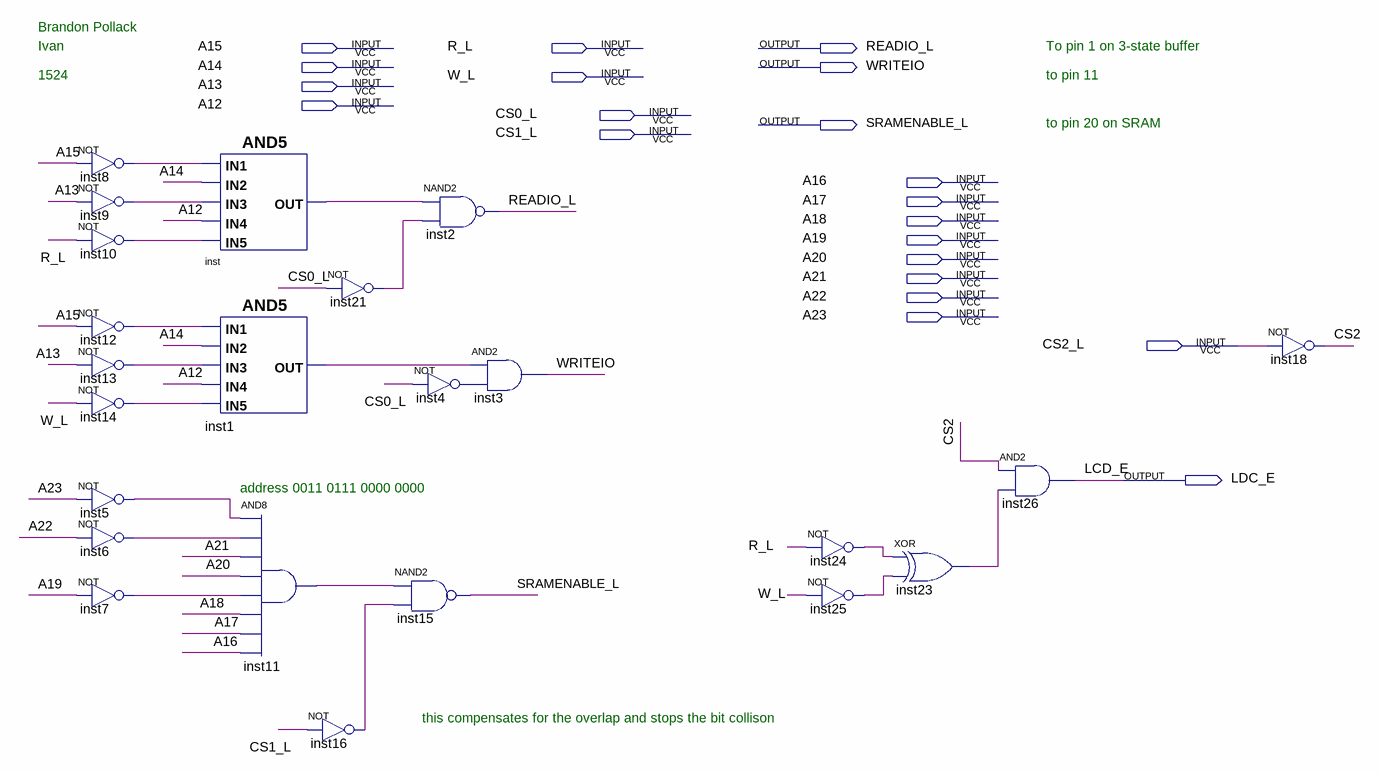
[diagram p0: schematic sheet]
// Quartus schematic AddressDecode.bdf as structural Verilog: 23 symbols, 21 pins
module AddressDecode (
  input  A15,
  input  R_L,
  input  A14,
  input  W_L,
  input  A13,
  input  A12,
  input  CS0_L,
  input  CS1_L,
  input  A16,
  input  A17,
  input  A18,
  input  A19,
  input  A20,
  input  A21,
  input  A22,
  input  A23,
  input  CS2_L,
  output READIO_L,
  output WRITEIO,
  output SRAMENABLE_L,
  output LDC_E
);

  wire CS2, inst1_out, inst4_out, inst5_out, inst6_out, inst7_out, inst8_out, inst9_out, inst10_out,
       inst11_out, inst12_out, inst13_out, inst14_out, inst16_out, inst21_out, inst23_out, inst24_out,
       inst25_out, inst_out;

  not inst8 (inst8_out, A15);
  not inst9 (inst9_out, A13);
  not inst10 (inst10_out, R_L);
  not inst12 (inst12_out, A15);
  not inst13 (inst13_out, A13);
  not inst14 (inst14_out, W_L);
  not inst5 (inst5_out, A23);
  not inst6 (inst6_out, A22);
  not inst7 (inst7_out, A19);
  and inst (inst_out, inst8_out, A14, inst9_out, A12, inst10_out);
  and inst1 (inst1_out, inst12_out, A14, inst13_out, A12, inst14_out);
  and inst11 (inst11_out, inst5_out, inst6_out, A21, A20, inst7_out, A18, A17, A16);
  not inst21 (inst21_out, CS0_L);
  not inst16 (inst16_out, CS1_L);
  nand inst2 (READIO_L, inst_out, inst21_out);
  not inst4 (inst4_out, CS0_L);
  nand inst15 (SRAMENABLE_L, inst11_out, inst16_out);
  and inst3 (WRITEIO, inst1_out, inst4_out);
  not inst24 (inst24_out, R_L);
  not inst25 (inst25_out, W_L);
  xor inst23 (inst23_out, inst24_out, inst25_out);
  and inst26 (LDC_E, CS2, inst23_out);
  not inst18 (CS2, CS2_L);

  // Other names for the same wires on the sheet: LCD_E = LDC_E

  // Notes on the sheet:
  //   Brandon Pollack
  //   Ivan
  //   To pin 1 on 3-state buffer
  //   1524
  //   to pin 11
  //   to pin 20 on SRAM
  //   address 0011 0111 0000 0000
  //   this compensates for the overlap and stops the bit collison
endmodule
